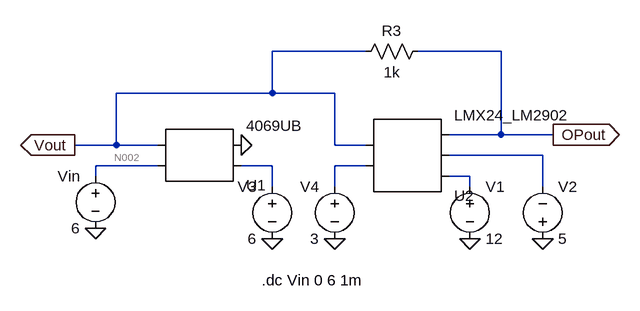
[diagram p0: schematic Q1.asc]
* Q1.asc
Vin N002 0 6
* U2: LMX24_LM2902 (symbol AutoGenerated\LMX24_LM2902 not available, pins judged from their places): pin1=N004 pin2=Vout pin3=N005 pin4=N001 pin5=OPout
V1 N005 0 12
V2 0 N001 5
R3 OPout Vout 1k
* U1: 4069UB (symbol AutoGenerated\4069UB not available, pins judged from their places): pin1=N002 pin2=Vout pin3=N003 pin4=0
V3 N003 0 6
V4 N004 0 3
.dc Vin 0 6 1m
.backanno
.end

* Results of the author's LTspice run, read from the files saved beside the schematic
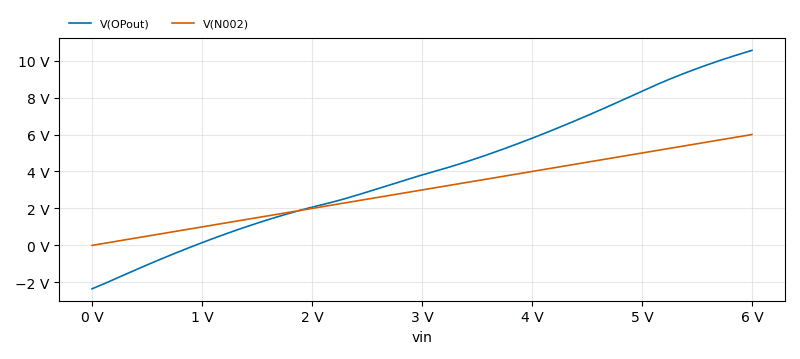
[diagram p1: DC transfer characteristic of Q1.asc, plotted from the saved traces]
* DC transfer characteristic, 1 run:
*   V(OPout): -2.35 V at vin=0 V, 10.55 V at vin=6 V, min -2.35 V, max 10.55 V
*   V(N002): 0 V at vin=0 V, 6 V at vin=6 V, min 0 V, max 6 V